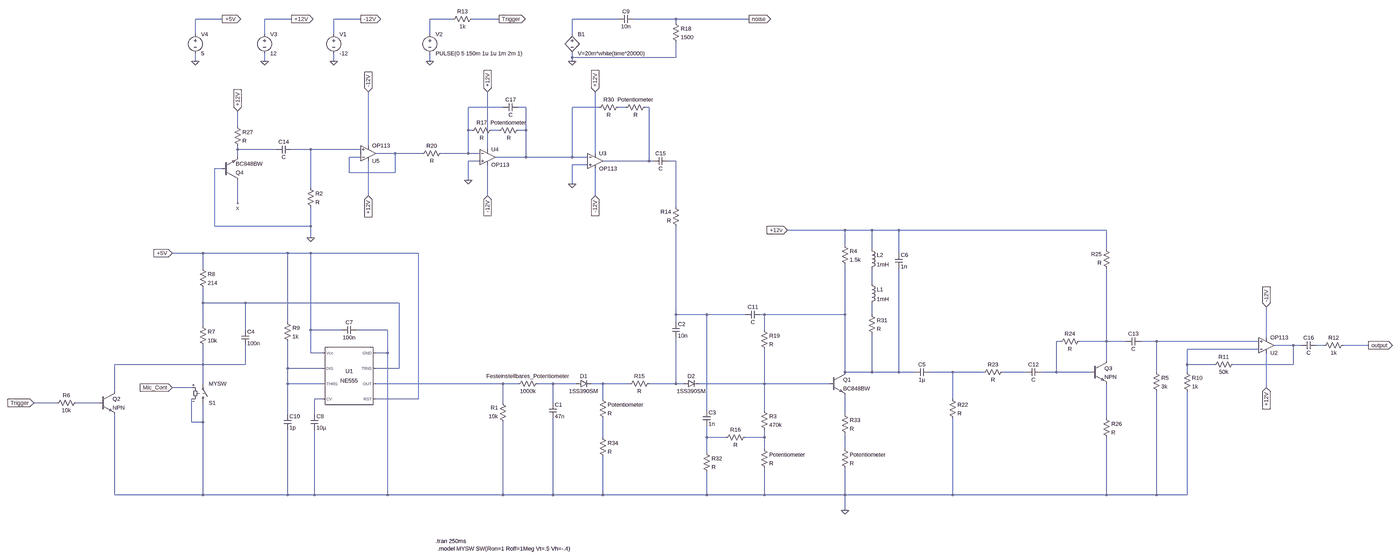
[diagram p0: schematic Finale.asc, whole sheet]
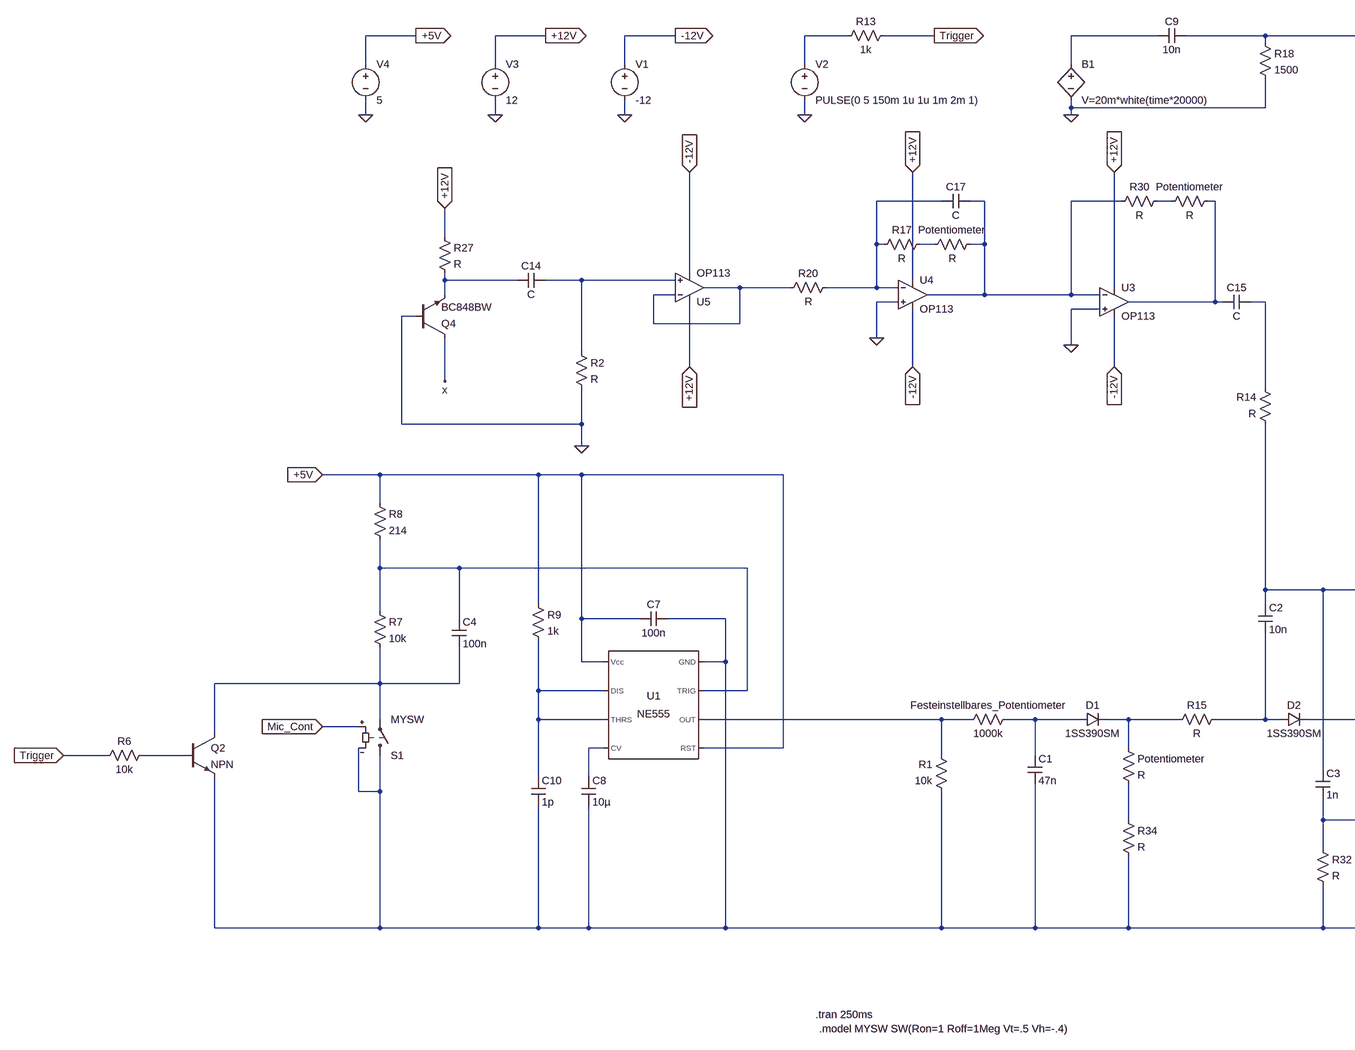
[diagram p1: schematic Finale.asc, part, row 1 of 1, column 1 of 2]
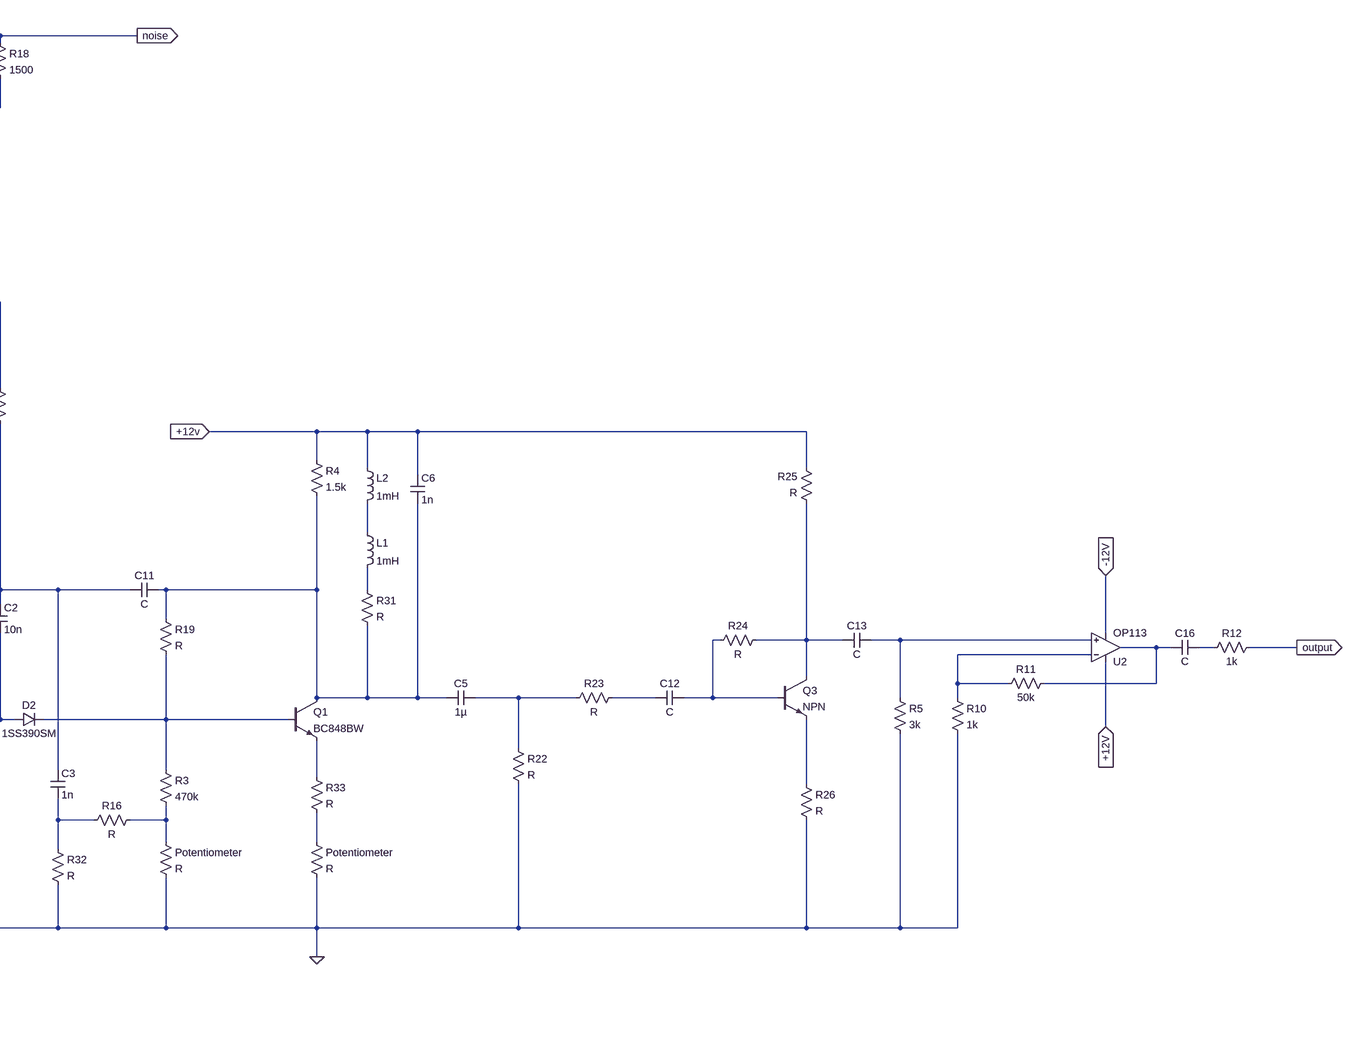
[diagram p2: schematic Finale.asc, part, row 1 of 1, column 2 of 2]
Finale.asc, the LTspice schematic file:
Version 4
SHEET 1 5112 680
WIRE -256 -1648 -368 -1648
WIRE 32 -1648 -80 -1648
WIRE 320 -1648 208 -1648
WIRE 704 -1648 608 -1648
WIRE 896 -1648 784 -1648
WIRE 1392 -1648 1200 -1648
WIRE 1632 -1648 1456 -1648
WIRE 1936 -1648 1632 -1648
WIRE 1632 -1632 1632 -1648
WIRE -368 -1584 -368 -1648
WIRE -80 -1584 -80 -1648
WIRE 208 -1584 208 -1648
WIRE 608 -1584 608 -1648
WIRE 1200 -1584 1200 -1648
WIRE 1200 -1488 1200 -1504
WIRE 1632 -1488 1632 -1552
WIRE 1632 -1488 1200 -1488
WIRE -368 -1472 -368 -1504
WIRE -80 -1472 -80 -1504
WIRE 208 -1472 208 -1504
WIRE 608 -1472 608 -1504
WIRE 1200 -1472 1200 -1488
WIRE 912 -1280 768 -1280
WIRE 1008 -1280 976 -1280
WIRE 1312 -1280 1200 -1280
WIRE 1424 -1280 1392 -1280
WIRE 1520 -1280 1504 -1280
WIRE -192 -1200 -192 -1264
WIRE 768 -1184 768 -1280
WIRE 784 -1184 768 -1184
WIRE 896 -1184 864 -1184
WIRE 1008 -1184 1008 -1280
WIRE 1008 -1184 976 -1184
WIRE 352 -1120 352 -1344
WIRE -192 -1104 -192 -1120
WIRE -32 -1104 -192 -1104
WIRE 112 -1104 32 -1104
WIRE 320 -1104 112 -1104
WIRE 848 -1104 848 -1344
WIRE 464 -1088 384 -1088
WIRE 576 -1088 464 -1088
WIRE 768 -1088 768 -1184
WIRE 768 -1088 656 -1088
WIRE 816 -1088 768 -1088
WIRE 1296 -1088 1296 -1344
WIRE -192 -1072 -192 -1104
WIRE 320 -1072 272 -1072
WIRE 1008 -1072 1008 -1184
WIRE 1008 -1072 880 -1072
WIRE 1200 -1072 1200 -1280
WIRE 1200 -1072 1008 -1072
WIRE 1264 -1072 1200 -1072
WIRE 816 -1056 768 -1056
WIRE 1520 -1056 1520 -1280
WIRE 1520 -1056 1328 -1056
WIRE 1536 -1056 1520 -1056
WIRE 1632 -1056 1600 -1056
WIRE 1264 -1040 1200 -1040
WIRE -256 -1024 -288 -1024
WIRE 272 -1008 272 -1072
WIRE 464 -1008 464 -1088
WIRE 464 -1008 272 -1008
WIRE 768 -976 768 -1056
WIRE 1200 -960 1200 -1040
WIRE 112 -944 112 -1104
WIRE 352 -912 352 -1056
WIRE 848 -912 848 -1040
WIRE 1296 -912 1296 -1024
WIRE -192 -880 -192 -976
WIRE 1632 -864 1632 -1056
WIRE -288 -784 -288 -1024
WIRE 112 -784 112 -864
WIRE 112 -784 -288 -784
WIRE 2384 -768 2096 -768
WIRE 2496 -768 2384 -768
WIRE 2608 -768 2496 -768
WIRE 3472 -768 2608 -768
WIRE 112 -736 112 -784
WIRE 2384 -704 2384 -768
WIRE 2496 -688 2496 -768
WIRE 3472 -688 3472 -768
WIRE -336 -672 -464 -672
WIRE 16 -672 -336 -672
WIRE 112 -672 16 -672
WIRE 560 -672 112 -672
WIRE 2608 -672 2608 -768
WIRE -336 -608 -336 -672
WIRE 2496 -544 2496 -608
WIRE -336 -464 -336 -528
WIRE -160 -464 -336 -464
WIRE 480 -464 -160 -464
WIRE 1632 -416 1632 -784
WIRE 1760 -416 1632 -416
WIRE 1920 -416 1760 -416
WIRE 2000 -416 1984 -416
WIRE 2384 -416 2384 -624
WIRE 2384 -416 2000 -416
WIRE 2496 -416 2496 -464
WIRE 16 -384 16 -672
WIRE 1632 -384 1632 -416
WIRE -336 -368 -336 -464
WIRE -160 -352 -160 -464
WIRE 112 -352 112 -672
WIRE 240 -352 112 -352
WIRE 432 -352 304 -352
WIRE 2000 -352 2000 -416
WIRE 4144 -320 4144 -448
WIRE 3280 -304 3264 -304
WIRE 3472 -304 3472 -608
WIRE 3472 -304 3360 -304
WIRE 3552 -304 3472 -304
WIRE 3680 -304 3616 -304
WIRE 4112 -304 3680 -304
WIRE 4256 -288 4176 -288
WIRE 4288 -288 4256 -288
WIRE 4384 -288 4352 -288
WIRE 4592 -288 4464 -288
WIRE 4112 -272 3808 -272
WIRE 112 -256 112 -352
WIRE 160 -256 112 -256
WIRE 432 -256 432 -352
WIRE 432 -256 384 -256
WIRE 3472 -224 3472 -304
WIRE -336 -208 -336 -288
WIRE -336 -208 -704 -208
WIRE -160 -208 -160 -288
WIRE -160 -208 -336 -208
WIRE 3808 -208 3808 -272
WIRE 3920 -208 3808 -208
WIRE 4256 -208 4256 -288
WIRE 4256 -208 4000 -208
WIRE 16 -192 16 -304
WIRE 160 -192 16 -192
WIRE 480 -192 480 -464
WIRE 480 -192 384 -192
WIRE 2384 -176 2384 -416
WIRE 2496 -176 2496 -336
WIRE 2496 -176 2384 -176
WIRE 2608 -176 2608 -608
WIRE 2608 -176 2496 -176
WIRE 2672 -176 2608 -176
WIRE 2832 -176 2736 -176
WIRE 2960 -176 2832 -176
WIRE 3136 -176 3040 -176
WIRE 3264 -176 3264 -304
WIRE 3264 -176 3200 -176
WIRE 3408 -176 3264 -176
WIRE 3680 -176 3680 -304
WIRE 3808 -176 3808 -208
WIRE -336 -128 -336 -208
WIRE 16 -128 16 -192
WIRE 160 -128 16 -128
WIRE 912 -128 384 -128
WIRE 976 -128 912 -128
WIRE 1120 -128 1056 -128
WIRE 1216 -128 1120 -128
WIRE 1328 -128 1280 -128
WIRE 1440 -128 1328 -128
WIRE 1632 -128 1632 -320
WIRE 1632 -128 1520 -128
WIRE 1664 -128 1632 -128
WIRE 2000 -128 2000 -272
WIRE 2000 -128 1728 -128
WIRE 2320 -128 2000 -128
WIRE -384 -112 -464 -112
WIRE 4144 -112 4144 -256
WIRE -704 -96 -704 -208
WIRE 160 -64 128 -64
WIRE 560 -64 560 -672
WIRE 560 -64 384 -64
WIRE 1328 -64 1328 -128
WIRE 2832 -64 2832 -176
WIRE -944 -48 -1040 -48
WIRE -768 -48 -864 -48
WIRE 912 -48 912 -128
WIRE 1120 -48 1120 -128
WIRE 1760 -16 1760 -416
WIRE 2000 -16 2000 -128
WIRE 16 0 16 -128
WIRE 128 0 128 -64
WIRE 2384 0 2384 -80
WIRE 3472 16 3472 -128
WIRE -384 32 -384 -64
WIRE -336 32 -336 -48
WIRE -336 32 -384 32
WIRE 1328 96 1328 16
WIRE 1760 96 1760 48
WIRE 1840 96 1760 96
WIRE 2000 96 2000 64
WIRE 2000 96 1920 96
WIRE 2000 144 2000 96
WIRE 2384 144 2384 80
WIRE 1760 160 1760 96
WIRE -704 336 -704 0
WIRE -336 336 -336 32
WIRE -336 336 -704 336
WIRE 16 336 16 64
WIRE 16 336 -336 336
WIRE 128 336 128 64
WIRE 128 336 16 336
WIRE 432 336 432 -256
WIRE 432 336 128 336
WIRE 912 336 912 32
WIRE 912 336 432 336
WIRE 1120 336 1120 16
WIRE 1120 336 912 336
WIRE 1328 336 1328 176
WIRE 1328 336 1120 336
WIRE 1760 336 1760 240
WIRE 1760 336 1328 336
WIRE 2000 336 2000 224
WIRE 2000 336 1760 336
WIRE 2384 336 2384 224
WIRE 2384 336 2000 336
WIRE 2832 336 2832 16
WIRE 2832 336 2384 336
WIRE 3472 336 3472 96
WIRE 3472 336 2832 336
WIRE 3680 336 3680 -96
WIRE 3680 336 3472 336
WIRE 3808 336 3808 -96
WIRE 3808 336 3680 336
WIRE 2384 400 2384 336
FLAG 320 -1648 -12V
IOPIN 320 -1648 Out
FLAG 208 -1472 0
FLAG 896 -1648 Trigger
IOPIN 896 -1648 Out
FLAG 608 -1472 0
FLAG 2096 -768 +12v
IOPIN 2096 -768 In
FLAG 4592 -288 output
IOPIN 4592 -288 Out
FLAG 1200 -1472 0
FLAG 1936 -1648 noise
IOPIN 1936 -1648 Out
FLAG 2384 400 0
FLAG -464 -112 Mic_Cont
IOPIN -464 -112 In
FLAG -1040 -48 Trigger
IOPIN -1040 -48 In
FLAG -464 -672 +5V
IOPIN -464 -672 In
FLAG 32 -1648 +12V
IOPIN 32 -1648 Out
FLAG -80 -1472 0
FLAG -256 -1648 +5V
IOPIN -256 -1648 Out
FLAG -368 -1472 0
FLAG 4144 -448 -12V
IOPIN 4144 -448 In
FLAG 4144 -112 +12V
IOPIN 4144 -112 In
FLAG -192 -1264 +12V
IOPIN -192 -1264 In
FLAG -192 -880 x
FLAG 112 -736 0
FLAG 352 -1344 -12V
IOPIN 352 -1344 In
FLAG 352 -912 +12V
IOPIN 352 -912 In
FLAG 1296 -912 -12V
IOPIN 1296 -912 In
FLAG 1296 -1344 +12V
IOPIN 1296 -1344 In
FLAG 1200 -960 0
FLAG 848 -912 -12V
IOPIN 848 -912 In
FLAG 848 -1344 +12V
IOPIN 848 -1344 In
FLAG 768 -976 0
SYMBOL voltage 208 -1600 R0
WINDOW 123 0 0 Left 0
WINDOW 39 0 0 Left 0
SYMATTR InstName V1
SYMATTR Value -12
SYMBOL voltage 608 -1600 R0
WINDOW 123 0 0 Left 0
WINDOW 39 0 0 Left 0
SYMATTR InstName V2
SYMATTR Value PULSE(0 5 150m 1u 1u 1m 2m 1)
SYMBOL bv 1200 -1600 R0
SYMATTR InstName B1
SYMATTR Value V=20m*white(time*20000)
SYMBOL cap 1456 -1664 R90
WINDOW 0 0 32 VBottom 2
WINDOW 3 32 32 VTop 2
SYMATTR InstName C9
SYMATTR Value 10n
SYMBOL res 1616 -1648 R0
SYMATTR InstName R18
SYMATTR Value 1500
SYMBOL res 928 48 R180
WINDOW 0 36 76 Left 2
WINDOW 3 36 40 Left 2
SYMATTR InstName R1
SYMATTR Value 10k
SYMBOL diode 1216 -112 R270
WINDOW 0 32 32 VTop 2
WINDOW 3 0 32 VBottom 2
SYMATTR InstName D1
SYMATTR Value 1SS390SM
SYMBOL cap 1104 -48 R0
SYMATTR InstName C1
SYMATTR Value 47n
SYMBOL res 1072 -144 R90
WINDOW 0 0 56 VBottom 2
WINDOW 3 32 56 VTop 2
SYMATTR InstName Festeinstellbares_Potentiometer
SYMATTR Value 1000k
SYMBOL cap 1616 -384 R0
SYMATTR InstName C2
SYMATTR Value 10n
SYMBOL diode 1664 -112 R270
WINDOW 0 32 32 VTop 2
WINDOW 3 0 32 VBottom 2
SYMATTR InstName D2
SYMATTR Value 1SS390SM
SYMBOL res 1984 -32 R0
SYMATTR InstName R3
SYMATTR Value 470k
SYMBOL cap 1744 -16 R0
SYMATTR InstName C3
SYMATTR Value 1n
SYMBOL npn 2320 -176 R0
SYMATTR InstName Q1
SYMATTR Value BC848BW
SYMBOL res 2368 -720 R0
SYMATTR InstName R4
SYMATTR Value 1.5k
SYMBOL cap 2736 -192 R90
WINDOW 0 0 32 VBottom 2
WINDOW 3 32 32 VTop 2
SYMATTR InstName C5
SYMATTR Value 1µ
SYMBOL ind 2480 -704 R0
SYMATTR InstName L2
SYMATTR Value 1mH
SYMBOL cap 2592 -672 R0
SYMATTR InstName C6
SYMATTR Value 1n
SYMBOL res -848 -64 R90
WINDOW 0 0 56 VBottom 2
WINDOW 3 32 56 VTop 2
SYMATTR InstName R6
SYMATTR Value 10k
SYMBOL npn -768 -96 R0
SYMATTR InstName Q2
SYMBOL sw -336 -32 M180
SYMATTR InstName S1
SYMATTR Value MYSW
SYMBOL res -352 -384 R0
SYMATTR InstName R7
SYMATTR Value 10k
SYMBOL res -352 -624 R0
SYMATTR InstName R8
SYMATTR Value 214
SYMBOL cap -176 -352 R0
SYMATTR InstName C4
SYMATTR Value 100n
SYMBOL Misc\\NE555 272 -160 M0
SYMATTR InstName U1
SYMBOL res 0 -400 R0
SYMATTR InstName R9
SYMATTR Value 1k
SYMBOL cap 304 -368 R90
WINDOW 0 0 32 VBottom 2
WINDOW 3 32 32 VTop 2
SYMATTR InstName C7
SYMATTR Value 100n
SYMBOL cap 112 0 R0
SYMATTR InstName C8
SYMATTR Value 10µ
SYMBOL cap 0 0 R0
SYMATTR InstName C10
SYMATTR Value 1p
SYMBOL voltage -80 -1600 R0
WINDOW 123 0 0 Left 0
WINDOW 39 0 0 Left 0
SYMATTR InstName V3
SYMATTR Value 12
SYMBOL voltage -368 -1600 R0
WINDOW 123 0 0 Left 0
WINDOW 39 0 0 Left 0
SYMATTR InstName V4
SYMATTR Value 5
SYMBOL res 3664 -192 R0
SYMATTR InstName R5
SYMATTR Value 3k
SYMBOL OpAmps\\OP113 4144 -224 M180
SYMATTR InstName U2
SYMBOL res 3792 -192 R0
SYMATTR InstName R10
SYMATTR Value 1k
SYMBOL res 4016 -224 R90
WINDOW 0 0 56 VBottom 2
WINDOW 3 32 56 VTop 2
SYMATTR InstName R11
SYMATTR Value 50k
SYMBOL res 4480 -304 R90
WINDOW 0 0 56 VBottom 2
WINDOW 3 32 56 VTop 2
SYMATTR InstName R12
SYMATTR Value 1k
SYMBOL res 800 -1664 R90
WINDOW 0 0 56 VBottom 2
WINDOW 3 32 56 VTop 2
SYMATTR InstName R13
SYMATTR Value 1k
SYMBOL res 1312 -80 R0
SYMATTR InstName Potentiometer
SYMBOL res 1536 -144 R90
WINDOW 0 0 56 VBottom 2
WINDOW 3 32 56 VTop 2
SYMATTR InstName R15
SYMBOL cap 1984 -432 R90
WINDOW 0 0 32 VBottom 2
WINDOW 3 32 32 VTop 2
SYMATTR InstName C11
SYMBOL res 1984 -368 R0
SYMATTR InstName R19
SYMBOL res 1936 80 R90
WINDOW 0 0 56 VBottom 2
WINDOW 3 32 56 VTop 2
SYMATTR InstName R16
SYMBOL res 1984 128 R0
SYMATTR InstName Potentiometer
SYMBOL res 2816 -80 R0
SYMATTR InstName R22
SYMBOL res 3056 -192 R90
WINDOW 0 0 56 VBottom 2
WINDOW 3 32 56 VTop 2
SYMATTR InstName R23
SYMBOL cap 3200 -192 R90
WINDOW 0 0 32 VBottom 2
WINDOW 3 32 32 VTop 2
SYMATTR InstName C12
SYMBOL res 3376 -320 R90
WINDOW 0 0 56 VBottom 2
WINDOW 3 32 56 VTop 2
SYMATTR InstName R24
SYMBOL res 3488 -592 R180
WINDOW 0 36 76 Left 2
WINDOW 3 36 40 Left 2
SYMATTR InstName R25
SYMBOL npn 3408 -224 R0
SYMATTR InstName Q3
SYMBOL res 3456 0 R0
SYMATTR InstName R26
SYMBOL cap 3616 -320 R90
WINDOW 0 0 32 VBottom 2
WINDOW 3 32 32 VTop 2
SYMATTR InstName C13
SYMBOL res -208 -1216 R0
SYMATTR InstName R27
SYMBOL npn -256 -976 M180
SYMATTR InstName Q4
SYMATTR Value BC848BW
SYMBOL cap 32 -1120 R90
WINDOW 0 0 32 VBottom 2
WINDOW 3 32 32 VTop 2
SYMATTR InstName C14
SYMBOL OpAmps\\OP113 352 -1024 M180
SYMATTR InstName U5
SYMBOL OpAmps\\OP113 1296 -1120 R0
SYMATTR InstName U3
SYMBOL res 1408 -1296 R90
WINDOW 0 0 56 VBottom 2
WINDOW 3 32 56 VTop 2
SYMATTR InstName R30
SYMBOL cap 1600 -1072 R90
WINDOW 0 0 32 VBottom 2
WINDOW 3 32 32 VTop 2
SYMATTR InstName C15
SYMBOL cap 4352 -304 R90
WINDOW 0 0 32 VBottom 2
WINDOW 3 32 32 VTop 2
SYMATTR InstName C16
SYMBOL ind 2480 -560 R0
SYMATTR InstName L1
SYMATTR Value 1mH
SYMBOL res 2480 -432 R0
SYMATTR InstName R31
SYMBOL res 1744 144 R0
SYMATTR InstName R32
SYMBOL res 2368 -16 R0
SYMATTR InstName R33
SYMBOL res 2368 128 R0
SYMATTR InstName Potentiometer
SYMBOL res 1312 80 R0
SYMATTR InstName R34
SYMBOL res 96 -960 R0
SYMATTR InstName R2
SYMBOL res 1520 -1296 R90
WINDOW 0 0 56 VBottom 2
WINDOW 3 32 56 VTop 2
SYMATTR InstName Potentiometer
SYMBOL res 1648 -768 R180
WINDOW 0 36 76 Left 2
WINDOW 3 36 40 Left 2
SYMATTR InstName R14
SYMBOL OpAmps\\OP113 848 -1136 R0
SYMATTR InstName U4
SYMBOL res 992 -1200 R90
WINDOW 0 0 56 VBottom 2
WINDOW 3 32 56 VTop 2
SYMATTR InstName Potentiometer
SYMBOL cap 976 -1296 R90
WINDOW 0 0 32 VBottom 2
WINDOW 3 32 32 VTop 2
SYMATTR InstName C17
SYMBOL res 672 -1104 R90
WINDOW 0 0 56 VBottom 2
WINDOW 3 32 56 VTop 2
SYMATTR InstName R20
SYMBOL res 880 -1200 R90
WINDOW 0 0 56 VBottom 2
WINDOW 3 32 56 VTop 2
SYMATTR InstName R17
TEXT 632 528 Left 2 !.tran 250ms
TEXT 640 560 Left 2 !.model MYSW SW(Ron=1 Roff=1Meg Vt=.5 Vh=-.4)

The netlist it stands for:
* Finale.asc
V1 -12V 0 -12
V2 N001 0 PULSE(0 5 150m 1u 1u 1m 2m 1)
B1 N002 0 V=20m*white(time*20000)
C9 noise N002 10n
R18 noise 0 1500
R1 0 N027 10k
D1 N028 N029 1SS390SM
C1 N028 0 47n
R§Festeinstellbares_Potentiometer N028 N027 1000k
C2 N014 N030 10n
D2 N030 N031 1SS390SM
R3 N031 N038 470k
C3 N014 N037 1n
Q1 N015 N031 N034 0 BC848BW
R4 +12v N015 1.5k
C5 N025 N015 1µ
L2 +12v N012 1mH
C6 +12v N015 1n
R6 N033 Trigger 10k
Q2 N023 N033 0 0 NPN
S1 0 N023 Mic_Cont 0 MYSW
R7 N013 N023 10k
R8 +5V N013 214
C4 N013 N023 100n
XU1 0 N013 N027 +5V N032 N024 N024 +5V NE555  ; pins GND TRIG OUT RST CV THRS DIS Vcc
R9 +5V N024 1k
C7 0 +5V 100n
C8 N032 0 10µ
C10 N024 0 1p
V3 +12v 0 12
V4 +5V 0 5
R5 N019 0 3k
XU2 N019 N022 +12v -12V N020 OP113  ; pins In+ In- V+ V- OUT
R10 N022 0 1k
R11 N020 N022 50k
R12 output N021 1k
R13 Trigger N001 1k
R§Potentiometer N029 N036 R
R15 N030 N029 R
C11 N015 N014 C
R19 N015 N031 R
R16 N038 N037 R
R§Potentiometer N038 0 R
R22 N025 0 R
R23 N026 N025 R
C12 N017 N026 C
R24 N018 N017 R
R25 N018 +12v R
Q3 N018 N017 N035 0 NPN
R26 N035 0 R
C13 N019 N018 C
R27 +12v N008 R
Q4 x 0 N008 0 BC848BW
C14 N009 N008 C
XU5 N009 N010 +12v -12V N010 OP113  ; pins In+ In- V+ V- OUT
XU3 0 N004 +12v -12V N006 OP113  ; pins In+ In- V+ V- OUT
R30 N005 N004 R
C15 N011 N006 C
C16 N021 N020 C
L1 N012 N016 1mH
R31 N016 N015 R
R32 N037 0 R
R33 N034 N039 R
R§Potentiometer N039 0 R
R34 N036 0 R
R2 N009 0 R
R§Potentiometer N006 N005 R
R14 N014 N011 R
XU4 0 N003 +12v -12V N004 OP113  ; pins In+ In- V+ V- OUT
R§Potentiometer N004 N007 R
C17 N004 N003 C
R20 N003 N010 R
R17 N007 N003 R
.model D D
.lib standard.dio
.model NPN NPN
.model PNP PNP
.lib standard.bjt
.tran 250ms
.model MYSW SW(Ron=1 Roff=1Meg Vt=.5 Vh=-.4)
.lib NE555.sub
.lib ADI.lib
.backanno
.end